# EAGLE design Vaibhav( Data logger) (EAGLE 7.6.0)
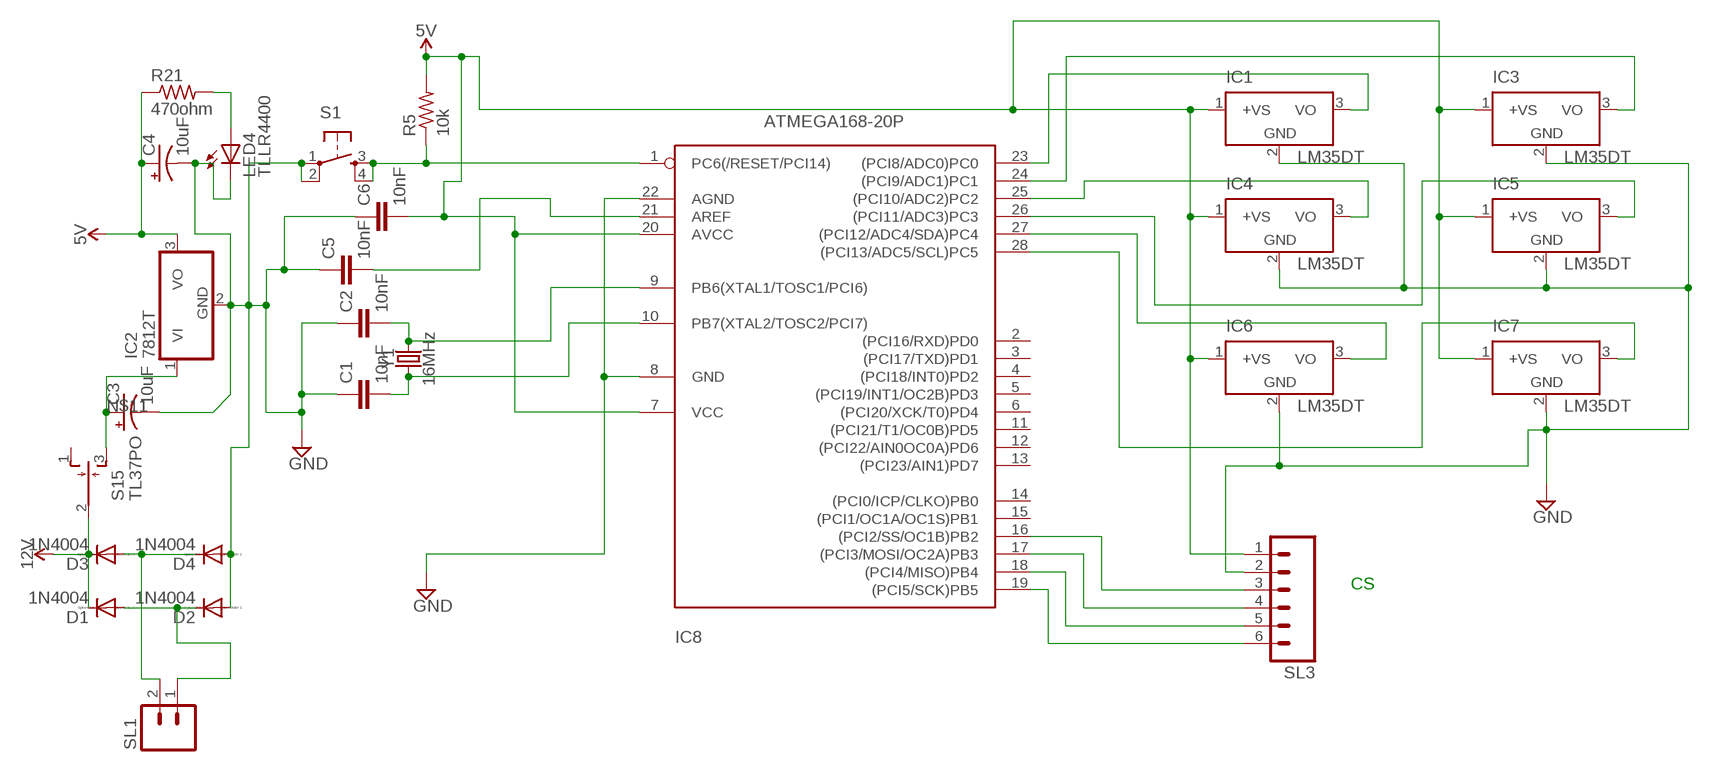
[diagram p0: schematic, sheet 1]

## Parts
C1  10nF  10NF-PTH-10MM-10000V-1-%  [CAP-PTH-10MM]
C2  10nF  10NF-PTH-10MM-10000V-1-%  [CAP-PTH-10MM]
C3  10uF  10UF-POLAR-RADIAL-2.5MM-KIT-25V-20%  [CPOL-RADIAL-2.5MM-5MM-KIT]
C4  10uF  10UF-POLAR-RADIAL-2.5MM-KIT-25V-20%  [CPOL-RADIAL-2.5MM-5MM-KIT]
C5  10nF  10NF-PTH-10MM-10000V-1-%  [CAP-PTH-10MM]
C6  10nF  10NF-PTH-10MM-10000V-1-%  [CAP-PTH-10MM]
D1  1N4004  [DO41-10]
D2  1N4004  [DO41-10]
D3  1N4004  [DO41-10]
D4  1N4004  [DO41-10]
IC1  LM35DT  [TO220V]
IC2  7812T  [TO220H]
IC3  LM35DT  [TO220V]
IC4  LM35DT  [TO220V]
IC5  LM35DT  [TO220V]
IC6  LM35DT  [TO220V]
IC7  LM35DT  [TO220V]
IC8  ATMEGA168-20P  [DIL28-3]
LED4  TLLR4400  [LED3MM]
R5  10k  R-US_0207/12  [0207/12]
R21  470ohm  R-US_0207/12  [0207/12]
S1  TAC_SWITCHPTH  [TACTILE-PTH]
S15  TL37PO  [TL3XPO]
SL1  MA02  [02PA]
SL3  MA06  [06PA]
Y1  16MHz  CRYSTAL-16MHZPTH-HC49US  [HC49US]

## Nets
5V: C4.1(+) C6.2 IC1.1(+VS) IC2.3(VO) IC3.1(+VS) IC4.1(+VS) IC5.1(+VS) IC6.1(+VS) IC7.1(+VS) IC8.7(VCC) IC8.20(AVCC) R5.2 R21.1 SL3.1
12V: D1.C D3.C S15.2(P)
GND: C1.1 C2.1 C3.2(-) C4.2(-) C5.1 C6.1 D2.A D4.A IC1.2(GND) IC2.2(GND) IC3.2(GND) IC4.2(GND) IC5.2(GND) IC6.2(GND) IC7.2(GND) IC8.8(GND) IC8.22(AGND) LED4.K(C) S1.1 S1.2 SL3.2
N$1: IC1.3(VO) IC8.23((PCI8/ADC0)PC0)
N$2: IC3.3(VO) IC8.24((PCI9/ADC1)PC1)
N$3: C2.2 IC8.9(PB6(XTAL1/TOSC1/PCI6)) Y1.2
N$4: C1.2 IC8.10(PB7(XTAL2/TOSC2/PCI7)) Y1.1
N$5: LED4.A R21.2
N$6: C5.2 IC8.21(AREF)
N$7: IC4.3(VO) IC8.25((PCI10/ADC2)PC2)
N$8: IC5.3(VO) IC8.26((PCI11/ADC3)PC3)
N$9: IC8.1(PC6(/RESET/PCI14)) R5.1 S1.3 S1.4
N$10: D3.A D4.C SL1.2
N$11: C3.1(+) IC2.1(VI) S15.3(S)
N$12: IC6.3(VO) IC8.27((PCI12/ADC4/SDA)PC4)
N$13: IC7.3(VO) IC8.28((PCI13/ADC5/SCL)PC5)
N$14: IC8.19((PCI5/SCK)PB5) SL3.6
N$15: IC8.18((PCI4/MISO)PB4) SL3.5
N$16: IC8.17((PCI3/MOSI/OC2A)PB3) SL3.4
N$17: IC8.16((PCI2/SS/OC1B)PB2) SL3.3
N$50: D1.A D2.C SL1.1
Unconnected: IC8.2((PCI16/RXD)PD0) IC8.3((PCI17/TXD)PD1) IC8.4((PCI18/INT0)PD2) IC8.5((PCI19/INT1/OC2B)PD3) IC8.6((PCI20/XCK/T0)PD4) IC8.11((PCI21/T1/OC0B)PD5) IC8.12((PCI22/AIN0OC0A)PD6) IC8.13((PCI23/AIN1)PD7) IC8.14((PCI0/ICP/CLKO)PB0) IC8.15((PCI1/OC1A/OC1S)PB1) S15.1(O)

## Notes on the sheet
- CS

## Library data of the parts
C1 C2 C5 C6 = SparkFun-Capacitors:10NF: 0.01uF/10nF/10,000pF ceramic capacitors A capacitor is a passive two-terminal electrical component used to store electrical energy temporarily in an electric field. CAP-09321; PROD_ID: CAP-09321
C3 C4 = SparkFun-Capacitors:10UF-POLAR: 10.0µF polarized capacitors A capacitor is a passive two-terminal electrical component used to store electrical energy temporarily in an electric field.; PROD_ID: CAP-08440
D1-D4 = diode:1N4004: DIODE general purpose rectifier, 1 A
IC1 IC3-IC7 = lm35:LM35: Single-Supply Centigrade Temperature Sensor Vout = (10mV/°C x Temp °C) +5mmmV Source: http://www.national.com/ds/LM/LM35.pdf
IC2 = linear:78*: Positive VOLTAGE REGULATOR Source: http://cache.national.com/ds/LM/LM78L05.pdf http://www.fairchildsemi.com/ds/LM/LM7805.pdf
IC8 = adafruit:ATMEGA168*P: MICROCONTROLLER 16 kBytes FLASH 1 kBytes SRAM 512 Bytes EEPROM USART 8-channel 10 bit ADC
LED4 = led:TLLR4400: Low Current (2mA) LED 3 mm Tinted Diffused Package color RED Source: Data sheet <http://www.farnell.com/datasheets/391100.pdf>; MF: VISHAY SEMICONDUCTOR; OC_FARNELL: 1612437
R5 R21 = rcl:R-US_: RESISTOR, American symbol
S1 = SparkFun-Retired:TAC_SWITCH: Momentary Switch Button commonly used for reset or general input. Spark Fun Electronics SKU : COM-00097 SMT- SWCH-08247
S15 = switch:TL37PO: TINY SWITCH MOM OFF MOM Source: http://www2.produktinfo.conrad.com/datenblaetter/700000-724999/705152-da-01-de-Subminiaturschalter_TL_36YO.pdf
SL1 = con-amp-quick:MA02: AMP QUICK CONNECTOR; OC_FARNELL: unknown; OC_NEWARK: unknown
SL3 = con-amp-quick:MA06: AMP QUICK CONNECTOR; OC_FARNELL: unknown; OC_NEWARK: unknown
Y1 = SparkFun-Clocks:CRYSTAL-16MHZ: 16MHz Crystal Digikey Example <http://www.digikey.com/product-search/en?keywords=535-9122-1-ND> Frequency: 16MHz Frequency Stability: ±50ppm Frequency Tolerance: ±20ppm Load Capacitance: 18pF SparkFun Products: Pro Micro -5V/16MHz <https://www.sparkfun.com/products/12640> SparkFun Serial Enabled LCD Kit <https://www.sparkfun.com/products/10097>; PROD_ID: XTAL-08181; SF_ID: COM-00536

## Board
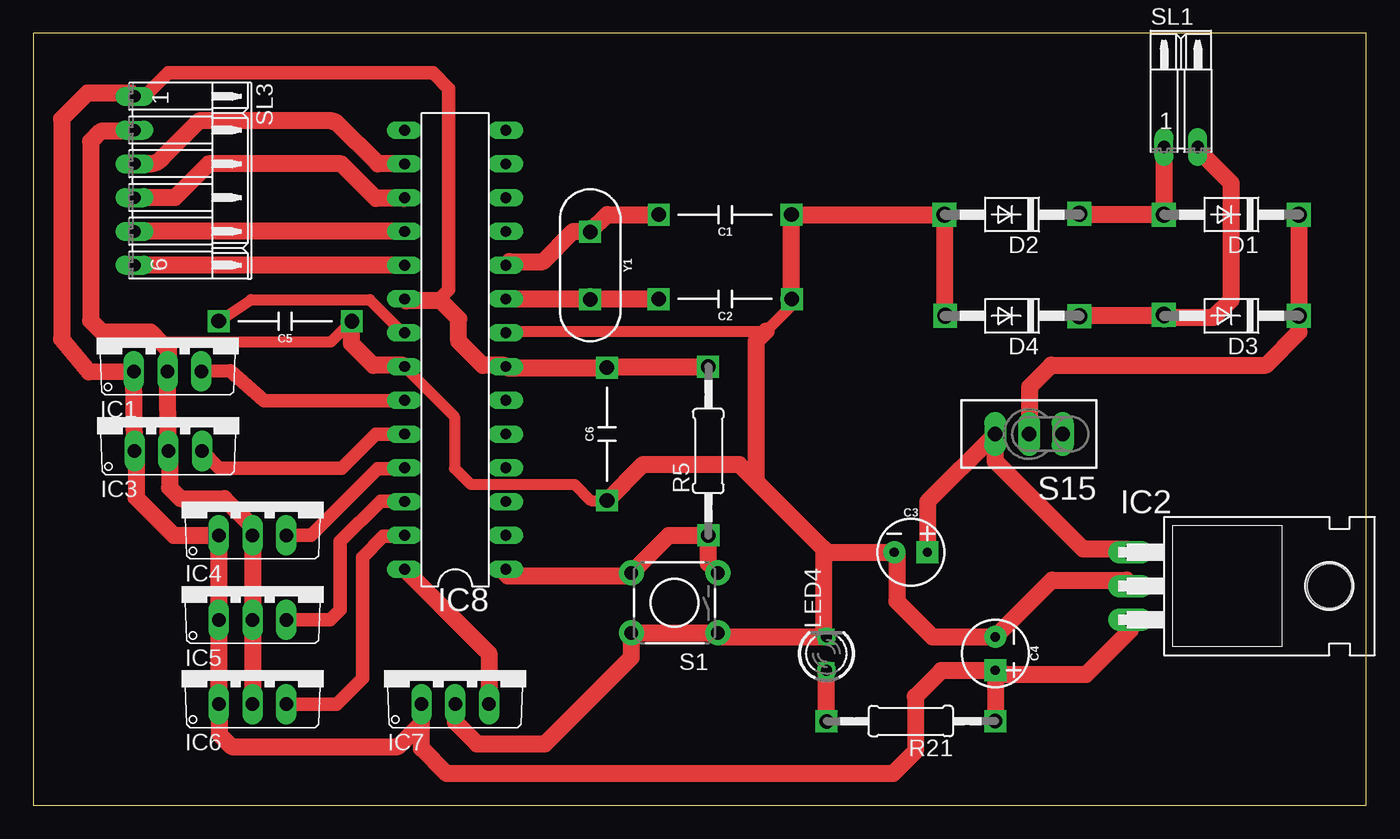
[diagram p1: board, top side]

Size 100.31 x 58.09 mm. Coordinates in mm from the lower left corner, seen from the top.
Outline: 0,0 100.31,0 100.31,58.09 0,58.09 0,0
Copper layers (1*16): Top 0.035mm / dielectric 1.5mm / Bottom 0.035mm
Design rules "default": minimum track width 10mil, minimum drill 24mil, track to track 8mil, track to pad 8mil, pad to pad 8mil, via to via 8mil, smd to smd 8mil, copper to edge 40mil, drill to drill 8mil, minimum pad ring 10mil, minimum via ring 8mil, stop-mask expansion 4mil, vias tented up to drill 0mil, thermal gap 10mil

### Footprints (pad centres in the part's own frame; a part is rotated, then mirrored left to right if it is on the bottom)
CAP-PTH-10MM = drill 0.9 pad 1.651: 1 -5,0; 2 5,0
CPOL-RADIAL-2.5MM-5MM-KIT = drill 0.7 pad 1.651 square: 1 1.25,0 | drill 0.7 pad 1.651: 2 -1.25,0
DO41-10 = drill 1.118: A 5.08,0; C -5.08,0
TO220V = drill 1.016 long: 1 -2.54,-2.54; 2 0,-2.54; 3 2.54,-2.54
TO220H = drill 1.118 long: 1 -2.54,-10.16; 2 0,-10.16; 3 2.54,-10.16 | hole 3.302: 0,4.826
DIL28-3 = drill 0.813 long: 1 -16.51,-3.81; 2 -13.97,-3.81; 3 -11.43,-3.81; 4 -8.89,-3.81; 5 -6.35,-3.81; 6 -3.81,-3.81; 7 -1.27,-3.81; 8 1.27,-3.81; 9 3.81,-3.81; 10 6.35,-3.81; 11 8.89,-3.81; 12 11.43,-3.81; 13 13.97,-3.81; 14 16.51,-3.81; 15 16.51,3.81; 16 13.97,3.81; 17 11.43,3.81; 18 8.89,3.81; 19 6.35,3.81; 20 3.81,3.81; 21 1.27,3.81; 22 -1.27,3.81; 23 -3.81,3.81; 24 -6.35,3.81; 25 -8.89,3.81; 26 -11.43,3.81; 27 -13.97,3.81; 28 -16.51,3.81
LED3MM = drill 0.813 octagon: A -1.27,0; K 1.27,0
0207/12 = drill 0.813 octagon: 1 -6.35,0; 2 6.35,0
TACTILE-PTH = drill 1.016 pad 1.88: 1 -3.251,2.261; 2 3.251,2.261; 3 -3.251,-2.261; 4 3.251,-2.261
TL3XPO = drill 1.1 pad 1.422 long: 1 -2.54,0; 2 0,0; 3 2.54,0
02PA = drill 0.914 long: 1 -1.27,0; 2 1.27,0
06PA = drill 0.914 long: 1 -6.35,0; 2 -3.81,0; 3 -1.27,0; 4 1.27,0; 5 3.81,0; 6 6.35,0
HC49US = drill 0.7 pad 1.651: 1 -2.54,0; 2 2.54,0

### Placement (x,y rotation side)
C1  52.07,44.45 180 top
C2  52.07,38.1 180 top
C3  66.04,19.05 0 top
C4  72.39,11.43 270 top
C5  18.95,36.43 180 top
C6  43.18,27.94 90 top
D1  90.17,44.45 180 top
D2  73.66,44.45 180 top
D3  90.17,36.83 180 top
D4  73.66,36.83 180 top
IC1  10.12,35.2 0 top
IC2  92.71,16.51 270 top
IC3  10.16,29.21 0 top
IC4  16.51,22.86 0 top
IC5  16.51,16.51 0 top
IC6  16.51,10.16 0 top
IC7  31.75,10.16 0 top
IC8  31.75,34.29 90 top
LED4  59.69,11.43 90 top
R5  50.8,26.67 90 top
R21  66.04,6.35 180 top
S1  48.26,15.24 180 top
S15  74.93,27.94 180 top
SL1  86.36,49.53 0 top
SL3  7.62,46.99 270 top
Y1  41.91,40.64 270 top

### Tracks (layer width: path | path; a pad name or v marks a point on that pad's centre or on a via)
5V
  Top 1.016: IC8.20 28.09,37.95 30.42,37.95 31.25,38.78 31.25,53.93 30.08,55.1 10.16,55.1 8.4,53.34 SL3.1
  Top 1.27: IC8.20 28.08,37.96 30.65,37.96 32.01,36.6 32.01,34.91 33.82,33.1 35.48,33.1 IC8.7 35.64,32.94 C6.2 43.26,33.02 R5.2 | SL3.1 7.37,53.59 4.08,53.59 2.14,51.65 2.14,35.08 4.19,32.61 IC1.1 IC3.1 7.74,26.55 7.74,23.16 10.58,20.32 IC4.1 IC5.1 IC6.1 14.01,7.58 14.01,5.37 14.94,4.43 27.46,4.43 29.21,6.19 IC7.1 29.21,4.3 31.11,2.4 64.69,2.4 66.38,4.08 66.38,8.19 68.34,10.15 72.36,10.15 C4.1 | C4.1 R21.1 | C4.1 72.7,9.87 79.24,9.87 82.55,13.18 IC2.3
12V
  Top 1.27: S15.2 74.98,27.99 74.98,31.5 76.61,33.13 92.78,33.13 95.25,35.6 D3.C D1.C
GND
  Top 0.813: C5.1 22.38,34.86 9.58,34.86 | IC8.8 35.68,35.69 55.15,35.69 57.07,37.61 C2.1 | IC8.22 31.7,29.26 31.7,25.36 32.91,24.14 40.74,24.14 41.94,22.94 C6.1
  Top 1.27: SL3.2 7.53,50.71 5.09,50.71 4.31,49.94 4.31,36.48 5.17,35.62 8.82,35.62 9.58,34.86 10.16,34.28 IC1.2 IC3.2 10.25,26.58 10.25,23.91 11.08,23.08 14.38,23.08 16.51,20.95 IC4.2 IC5.2 IC6.2 | IC7.2 31.77,7.6 31.77,6.26 33.39,4.64 38.5,4.64 45.01,11.15 S1.2 S1.1 51.79,12.7 LED4.K 59.5,12.89 59.5,19.29 | IC8.22 27.86,33.1 25.59,33.1 23.95,34.73 C5.1 | C2.1 C1.1 D2.A D4.A | C6.1 45.9,25.66 53.12,25.66 54.39,24.4 | 54.39,24.4 59.5,19.29 | 59.5,19.29 59.74,19.05 C3.2 64.98,18.86 64.98,15.38 67.68,12.68 C4.2 76.66,16.95 82.27,16.95 82.55,16.67 IC2.2 | 55.15,35.69 54.39,34.92 54.39,24.4
N$1
  Top 1.016: IC8.23 27.91,30.45 17.39,30.45 14.82,32.7 IC1.3
N$2
  Top 1.016: IC3.3 14,25.37 23.21,25.37 25.78,27.94 IC8.24
N$3
  Top 1.27: IC8.9 Y1.2 C2.2
N$4
  Top 1.27: IC8.10 35.83,40.91 38.36,40.91 40.63,43.18 Y1.1 43.18,44.45 C1.2
N$5
  Top 1.27: R21.2 LED4.A
N$6
  Top 0.813: C5.2 16.38,38.05 25.32,38.05 27.8,35.56 IC8.21
N$7
  Top 1.016: IC8.25 27.85,25.31 25.91,25.31 20.91,20.32 IC4.3
N$8
  Top 1.016: IC8.26 27.91,22.89 26.12,22.89 23.1,19.86 23.1,14.74 22.34,13.97 IC5.3
N$9
  Top 1.27: IC8.1 35.56,17.41 35.71,17.26 44.77,17.26 S1.4 47.83,20.32 R5.1 50.8,18.21 S1.3
N$10
  Top 1.27: SL1.2 87.63,49.33 90.14,46.82 90.14,38.03 88.81,36.71 85.21,36.71 D3.A D4.C
N$11
  Top 1.27: IC2.1 82.32,19.28 79.01,19.28 72.39,25.9 S15.3 67.29,22.84 C3.1
N$12
  Top 1.016: IC8.27 27.86,20.24 26.34,20.24 24.78,18.68 24.78,9.55 22.84,7.62 IC6.3
N$13
  Top 1.27: IC8.28 34.29,11.43 IC7.3
N$14
  Top 1.27: IC8.19 SL3.6
N$15
  Top 1.27: IC8.18 SL3.5
N$16
  Top 1.27: IC8.17 27.88,45.66 25.77,45.66 23.18,48.26 13.2,48.26 10.66,45.72 SL3.4
N$17
  Top 1.27: IC8.16 arc-45 27.93,48.26 25.93,48.26 22.87,51.33 arc45 22.59,51.44 arc45 22.46,51.49 12.49,51.49 9.63,48.63 arc-45 8.73,48.26 SL3.3
N$19  (via drill 1.2 pad 1.02)
  other vias: 68.56,44.43
N$20  (via drill 1.2 pad 1.02)
  other vias: 78.72,44.5
N$21  (via drill 1.2 pad 1.02)
  other vias: 85.07,44.43
N$22  (via drill 1.2 pad 1.02)
  other vias: 95.25,44.45
N$23  (via drill 1.2 pad 1.02)
  other vias: 85.07,36.92
N$24  (via drill 1.2 pad 1.02)
  other vias: 95.24,36.85
N$25  (via drill 1.2 pad 1.02)
  other vias: 78.73,36.8
N$26  (via drill 1.2 pad 1.02)
  other vias: 68.62,36.85
N$27  (via drill 0.8 pad 1.02)
  other vias: 59.7,10.18
N$28  (via drill 0.8 pad 1.02)
  other vias: 59.7,12.7
N$29  (via drill 1.1 pad 1.02)
  other vias: 59.69,6.33
N$30  (via drill 1.1 pad 1.02)
  other vias: 72.4,6.35
N$31  (via drill 1.1 pad 1.02)
  other vias: 47.06,38.09
N$32  (via drill 1.1 pad 1.02)
  other vias: 57.08,38.09
N$33  (via drill 1.1 pad 1.02)
  other vias: 57.06,44.45
N$34  (via drill 1.1 pad 1.02)
  other vias: 47.07,44.45
N$35  (via drill 1.1 pad 1.02)
  other vias: 41.91,43.15
N$36  (via drill 1.1 pad 1.02)
  other vias: 41.91,38.06
N$37  (via drill 1.1 pad 1.02)
  other vias: 43.17,32.94
N$38  (via drill 1.1 pad 1.02)
  other vias: 43.17,22.94
N$39  (via drill 1.1 pad 1.02)
  other vias: 23.98,36.43
N$40  (via drill 1.1 pad 1.02)
  other vias: 13.95,36.43
N$41  (via drill 1.1 pad 1.02)
  other vias: 50.79,33.01
N$42  (via drill 1.1 pad 1.02)
  other vias: 50.8,20.31
N$50
  Top 1.27: SL1.1 D1.A D2.C